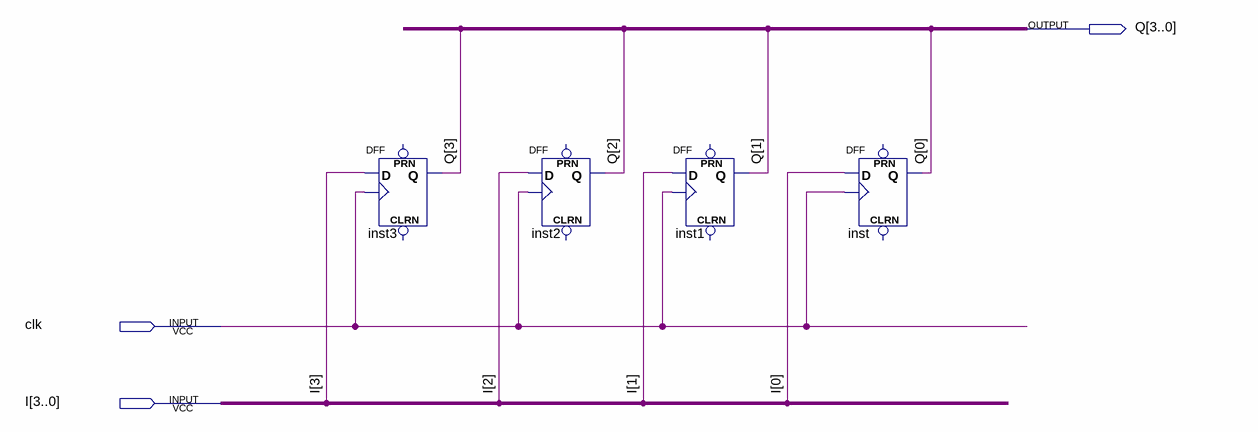
[diagram p0: schematic sheet]
// Quartus schematic reg.bdf as structural Verilog: 4 symbols, 3 pins
module \reg  (
  input  clk,
  input  [3:0] I,
  output [3:0] Q
);

  DFF inst3 (.CLK(clk), .D(I[3]), .Q(Q[3]));  // open: CLRN, PRN
  DFF inst2 (.CLK(clk), .D(I[2]), .Q(Q[2]));  // open: CLRN, PRN
  DFF inst1 (.CLK(clk), .D(I[1]), .Q(Q[1]));  // open: CLRN, PRN
  DFF inst (.CLK(clk), .D(I[0]), .Q(Q[0]));  // open: CLRN, PRN
endmodule
